# EAGLE design carSpd (EAGLE 8.0.1)

## Sheet 1 of 4
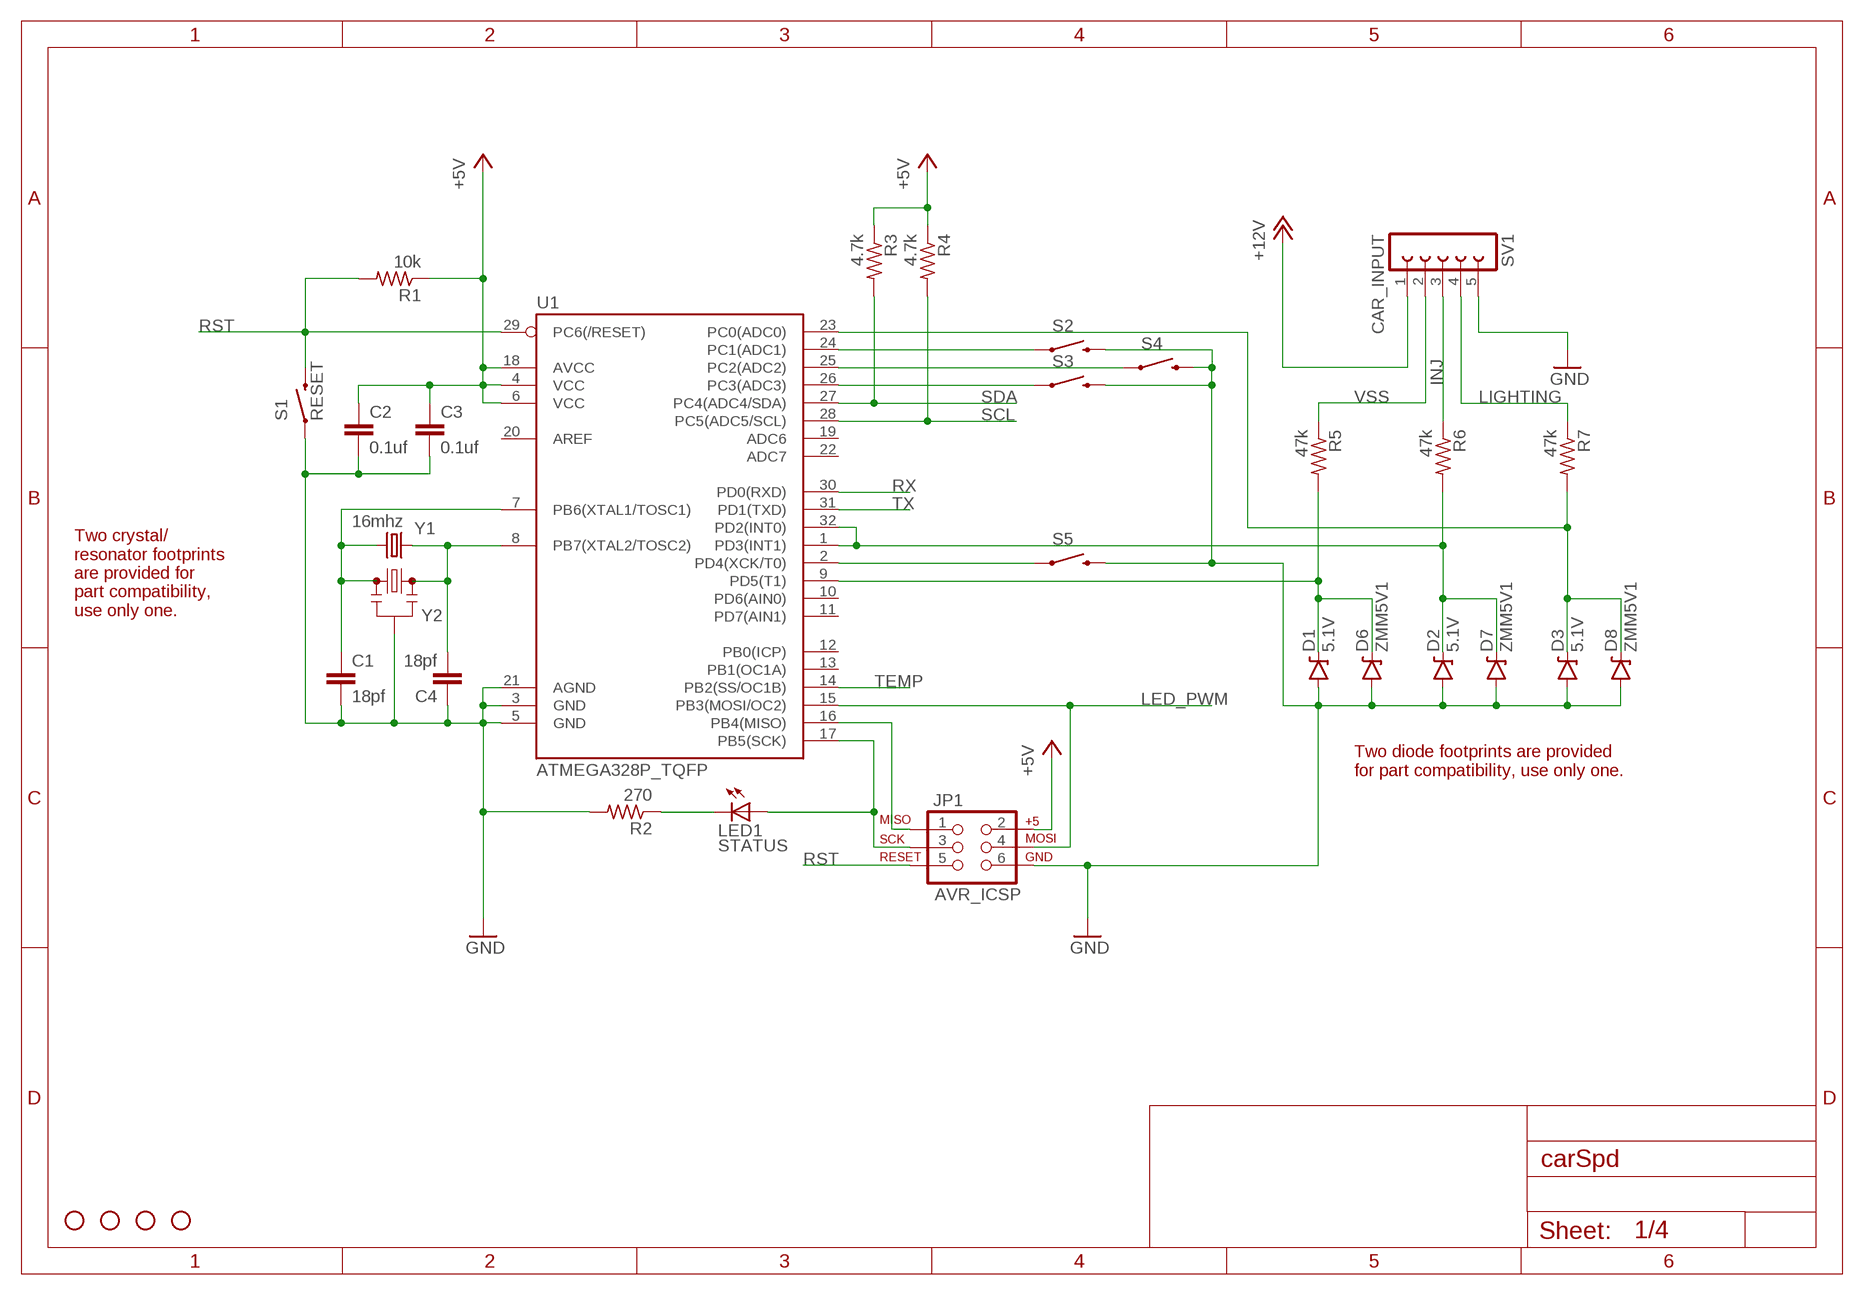
[diagram p0: schematic, sheet 1]

### Parts
C1  18pf  C-EUC0603K  [C0603K]
C2  0.1uf  C-EUC0603K  [C0603K]
C3  0.1uf  C-EUC0603K  [C0603K]
C4  18pf  C-EUC0603K  [C0603K]
D1  5.1V  DIODE-ZENER5.6V  [SOD-323]
D2  5.1V  DIODE-ZENER5.6V  [SOD-323]
D3  5.1V  DIODE-ZENER5.6V  [SOD-323]
D6  ZMM5V1  [SOD-80]
D7  ZMM5V1  [SOD-80]
D8  ZMM5V1  [SOD-80]
H1  STAND-OFF  [STAND-OFF]
H2  STAND-OFF  [STAND-OFF]
H3  STAND-OFF  [STAND-OFF]
H4  STAND-OFF  [STAND-OFF]
JP1  AVR_ICSP  AVR_SPI_PRG_6TESTPOINTS  [2X3_TEST_POINTS]
LED1  STATUS  LEDCHIPLED_0805  [CHIPLED_0805]
R1  10k  R-US_R0603  [R0603]
R2  270  R-US_R0603  [R0603]
R3  4.7k  R-US_R0805  [R0805]
R4  4.7k  R-US_R0805  [R0805]
R5  47k  R-US_R0805  [R0805]
R6  47k  R-US_R0805  [R0805]
R7  47k  R-US_R0805  [R0805]
S1  RESET  SWITCH-MOMENTARY-2SMD-1101NE  [TACTILE-SWITCH-1101NE]
S2  SWITCH-MOMENTARY-2SMD-1101NE  [TACTILE-SWITCH-1101NE]
S3  SWITCH-MOMENTARY-2SMD-1101NE  [TACTILE-SWITCH-1101NE]
S4  SWITCH-MOMENTARY-2SMD-1101NE  [TACTILE-SWITCH-1101NE]
S5  SWITCH-MOMENTARY-2SMD-1101NE  [TACTILE-SWITCH-1101NE]
SV1  CAR_INPUT  FE05W  [FE05W]
U1  ATMEGA328P_TQFP  [TQFP32-08]
Y1  16mhz  CRYSTAL5X3  [CRYSTAL-SMD-5X3]
Y2  16MHZ  RESONATOR16MHZ  [RESONATOR-SMD]

### Nets
+5V: C2.1 C3.1 JP1.2 R1.1 R3.1 R4.1 U1.4(VCC) U1.6(VCC) U1.18(AVCC) ; also sheet 2,3,4
+12V: SV1.1 ; also sheet 2
GND: C1.2 C2.2 C3.2 C4.1 D1.A D2.A D3.A D6.A D7.A D8.A JP1.6 R2.2 S1.1 S2.2 S3.2 S4.2 S5.2 SV1.5 U1.3(GND) U1.5(GND) U1.21(AGND) Y2.2 ; also sheet 2,3,4
INJ: R6.1 SV1.3
LED_PWM: JP1.4 U1.15(PB3(MOSI/OC2)) ; also sheet 4
LIGHTING: R7.1 SV1.4
N$5: S2.1 U1.24(PC1(ADC1))
N$6: S4.1 U1.25(PC2(ADC2))
N$7: S3.1 U1.26(PC3(ADC3))
N$13: S5.1 U1.2(PD4(XCK/T0))
N$22: JP1.1 U1.16(PB4(MISO))
N$24: C1.1 U1.7(PB6(XTAL1/TOSC1)) Y1.3 Y2.1
N$26: JP1.3 LED1.A U1.17(PB5(SCK))
N$30: D2.C D7.C R6.2 U1.1(PD3(INT1)) U1.32(PD2(INT0))
N$31: D3.C D8.C R7.2 U1.23(PC0(ADC0))
N$32: LED1.C R2.1
N$36: D1.C D6.C R5.2 U1.9(PD5(T1))
N$37: C4.2 U1.8(PB7(XTAL2/TOSC2)) Y1.1 Y2.3
RST: JP1.5 R1.2 S1.2 U1.29(PC6(/RESET)) ; also sheet 3
RX: U1.30(PD0(RXD)) ; also sheet 3
SCL: R4.2 U1.28(PC5(ADC5/SCL)) ; also sheet 4
SDA: R3.2 U1.27(PC4(ADC4/SDA)) ; also sheet 4
TEMP: U1.14(PB2(SS/OC1B)) ; also sheet 4
TX: U1.31(PD1(TXD)) ; also sheet 3
VSS: R5.1 SV1.2
Unconnected: U1.10(PD6(AIN0)) U1.11(PD7(AIN1)) U1.12(PB0(ICP)) U1.13(PB1(OC1A)) U1.19(ADC6) U1.20(AREF) U1.22(ADC7)

### Notes on the sheet
- Two crystal/
  resonator footprints
  are provided for 
  part compatibility,
  use only one.
- Two diode footprints are provided
  for part compatibility, use only one.

## Sheet 2 of 4: Power Regulation
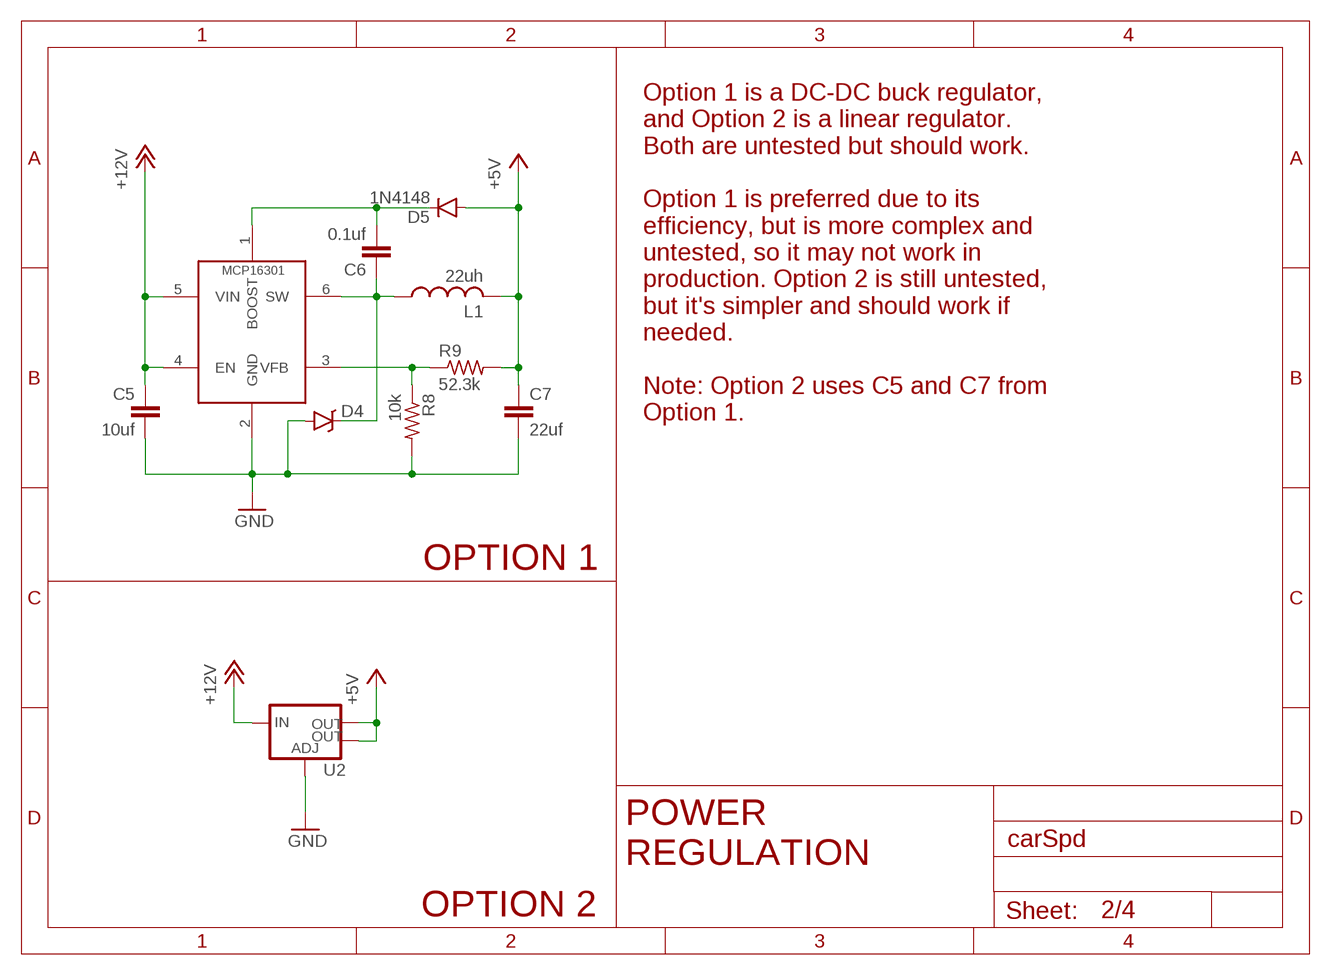
[diagram p1: schematic, sheet 2]

### Parts
C5  10uf  C-EUC0603K  [C0603K]
C6  0.1uf  C-EUC0603K  [C0603K]
C7  22uf  C-EUC0603K  [C0603K]
D4  DIODE-SCHOTTKY-BAT20J  [SOD-323]
D5  1N4148  DIODEBAS16  [SOD-323]
IC1  MCP16301/H  [SOT23-6]
L1  22uh  CBC2518T220M  [IND-1007/2518]
R8  10k  R-US_R0603  [R0603]
R9  52.3k  R-US_R0603  [R0603]
U2  V_REG_LM1117SOT223  [SOT223]

### Nets
+5V: C7.1 D5.A L1.P$2 R9.2 U2.2(OUT) U2.4(OUT) ; also sheet 1,3,4
+12V: C5.1 IC1.4(EN) IC1.5(VIN) U2.3(IN) ; also sheet 1
GND: C5.2 C7.2 D4.A IC1.2(GND) R8.2 U2.1(ADJ) ; also sheet 1,3,4
N$1: IC1.3(VFB) R8.1 R9.1
N$18: C6.1 D4.C IC1.6(SW) L1.P$1
N$19: C6.2 D5.C IC1.1(BOOST)

### Notes on the sheet
- MCP16301
- Option 1 is a DC-DC buck regulator,
  and Option 2 is a linear regulator.
  Both are untested but should work.
  
  Option 1 is preferred due to its
  efficiency, but is more complex and
  untested, so it may not work in 
  production. Option 2 is still untested,
  but it's simpler and should work if
  needed.
  
  Note: Option 2 uses C5 and C7 from
  Option 1.
- OPTION 1
- POWER
  REGULATION
- OPTION 2

## Sheet 3 of 4: USB to Serial
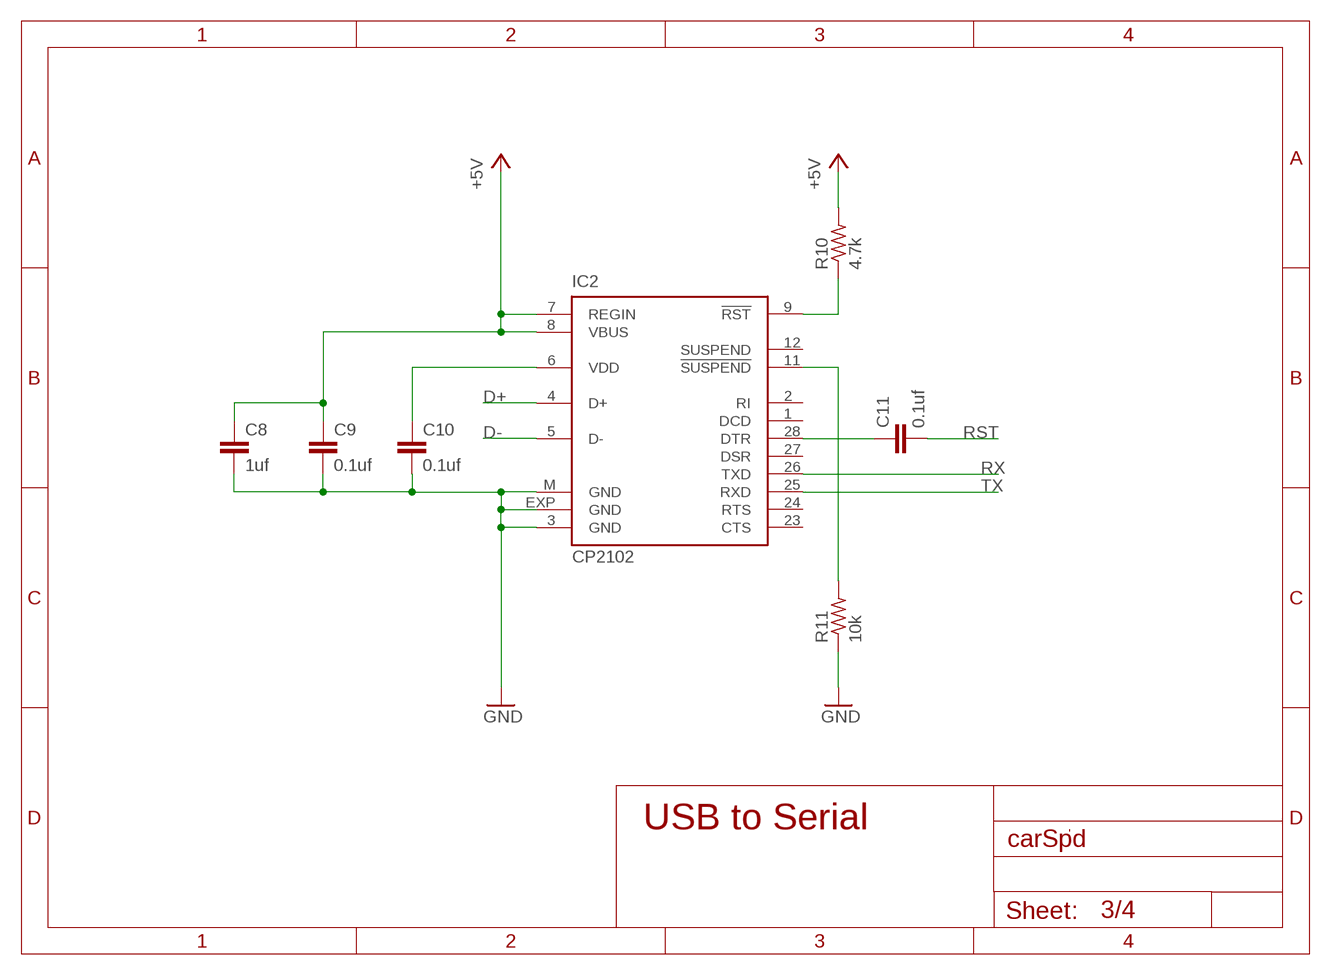
[diagram p2: schematic, sheet 3]

### Parts
C8  1uf  C-EUC0805K  [C0805K]
C9  0.1uf  C-EUC0603K  [C0603K]
C10  0.1uf  C-EUC0603K  [C0603K]
C11  0.1uf  C-EUC0603K  [C0603K]
IC2  CP2102  [MLP28]
R10  4.7k  R-US_R0805  [R0805]
R11  10k  R-US_R0603  [R0603]

### Nets
+5V: C8.1 C9.1 IC2.7(REGIN) IC2.8(VBUS) R10.2 ; also sheet 1,2,4
D+: IC2.4(D+) ; also sheet 4
D-: IC2.5(D-) ; also sheet 4
GND: C8.2 C9.2 C10.2 IC2.3(GND) IC2.EXP(GND) IC2.M(GND) R11.1 ; also sheet 1,2,4
N$4: IC2.9(!RST) R10.1
N$8: IC2.11(!SUSPEND) R11.2
N$10: C11.1 IC2.28(DTR)
N$12: C10.1 IC2.6(VDD)
RST: C11.2 ; also sheet 1
RX: IC2.26(TXD) ; also sheet 1
TX: IC2.25(RXD) ; also sheet 1
Unconnected: IC2.1(DCD) IC2.2(RI) IC2.12(SUSPEND) IC2.23(CTS) IC2.24(RTS) IC2.27(DSR)

### Notes on the sheet
- USB to Serial

## Sheet 4 of 4: Peripherals
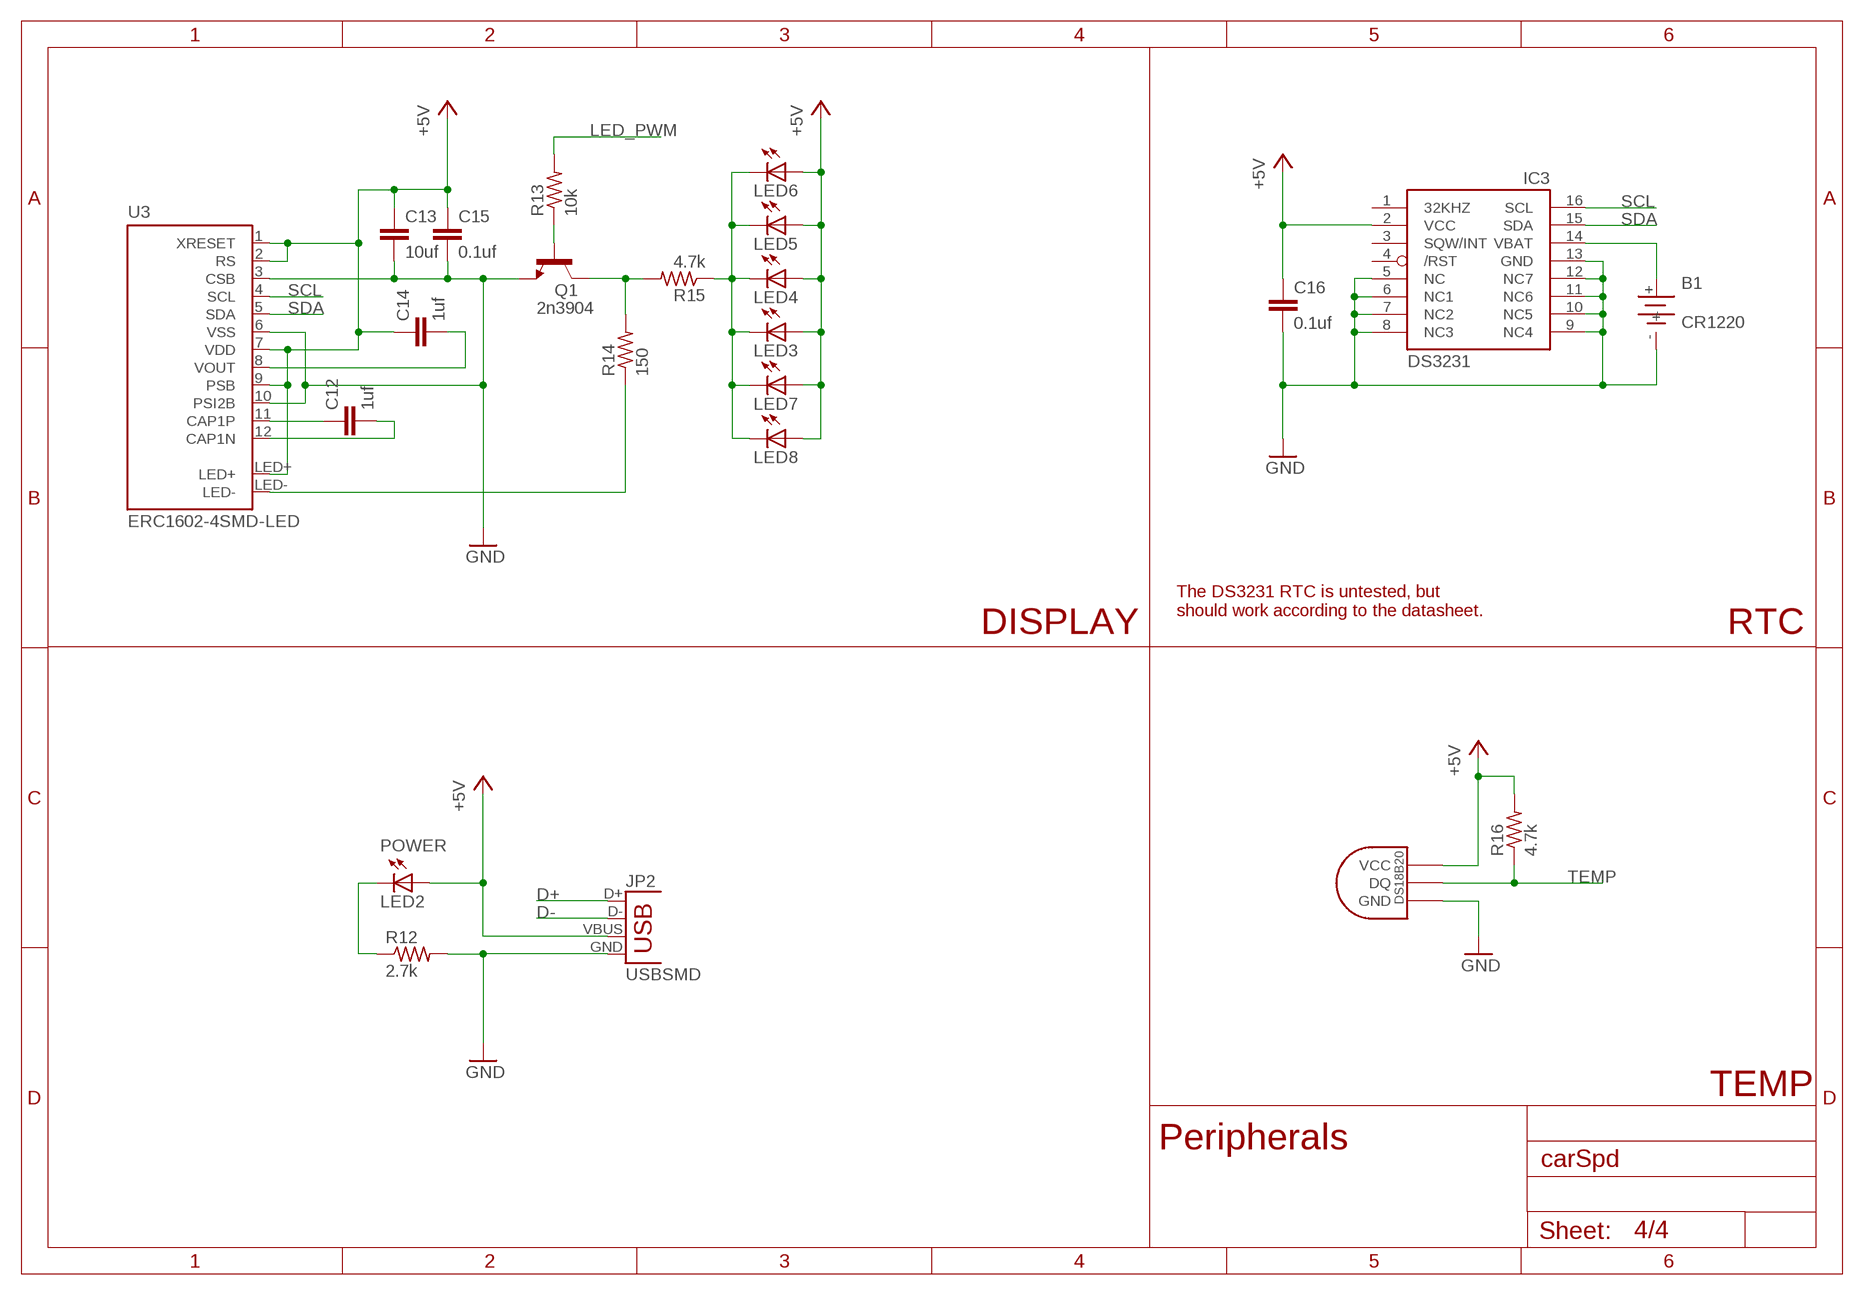
[diagram p3: schematic, sheet 4]

### Parts
B1  CR1220  BATTERY1220  [1220-SMD]
C12  1uf  C-EUC0805K  [C0805K]
C13  10uf  C-EUC0603K  [C0603K]
C14  1uf  C-EUC0805K  [C0805K]
C15  0.1uf  C-EUC0603K  [C0603K]
C16  0.1uf  C-EUC0603K  [C0603K]
IC3  DS3231/SO  [SO16W]
JP2  USBSMD  [USB-MINIB]
LED2  POWER  LEDCHIPLED_0805  [CHIPLED_0805]
LED3  LEDCHIPLED_0805  [CHIPLED_0805]
LED4  LEDCHIPLED_0805  [CHIPLED_0805]
LED5  LEDCHIPLED_0805  [CHIPLED_0805]
LED6  LEDCHIPLED_0805  [CHIPLED_0805]
LED7  LEDCHIPLED_0805  [CHIPLED_0805]
LED8  LEDCHIPLED_0805  [CHIPLED_0805]
Q1  2n3904  TRANSISTOR_NPNSOT23-3  [SOT23-3]
R12  2.7k  R-US_R0603  [R0603]
R13  10k  R-US_R0603  [R0603]
R14  150  R-US_R0603  [R0603]
R15  4.7k  R-US_R0805  [R0805]
R16  4.7k  R-US_R0805  [R0805]
U3  ERC1602-4SMD-LED  [ERC1602-4_SMDLED]
U4  DS1820  [µSOP8]

### Nets
+5V: C13.1 C14.1 C15.1 C16.1 IC3.2(VCC) JP2.VBUS LED2.A LED3.A LED4.A LED5.A LED6.A LED7.A LED8.A R16.2 U3.1(XRESET) U3.2(RS) U3.7(VDD) U3.9(PSB) U3.LED+ U4.8(VCC) ; also sheet 1,2,3
D+: JP2.D+ ; also sheet 3
D-: JP2.D- ; also sheet 3
GND: B1.- C13.2 C15.2 C16.2 IC3.5(NC) IC3.6(NC1) IC3.7(NC2) IC3.8(NC3) IC3.9(NC4) IC3.10(NC5) IC3.11(NC6) IC3.12(NC7) IC3.13(GND) JP2.GND Q1.2(E) R12.2 U3.3(CSB) U3.6(VSS) U3.10(PSI2B) U4.4(GND) ; also sheet 1,2,3
LED_PWM: R13.2 ; also sheet 1
N$2: LED3.C LED4.C LED5.C LED6.C LED7.C LED8.C R15.1
N$3: LED2.C R12.1
N$11: Q1.1(B) R13.1
N$14: C14.2 U3.8(VOUT)
N$15: Q1.3(C) R14.2 R15.2
N$16: R14.1 U3.LED-
N$20: C12.1 U3.11(CAP1P)
N$21: C12.2 U3.12(CAP1N)
N$27: B1.+ IC3.14(VBAT)
SCL: IC3.16(SCL) U3.4(SCL) ; also sheet 1
SDA: IC3.15(SDA) U3.5(SDA) ; also sheet 1
TEMP: R16.1 U4.1(DQ) ; also sheet 1
Unconnected: IC3.1(32KHZ) IC3.3(SQW/INT) IC3.4(/RST)

### Notes on the sheet
- The DS3231 RTC is untested, but 
  should work according to the datasheet.
- DISPLAY | RTC
- TEMP
- Peripherals

## Library data of the parts
B1 = Battery&Holder:BATTERY
C1-C16 = rcl:C-EU: CAPACITOR, European symbol
D1-D3 = SparkFun-DiscreteSemi:DIODE-ZENER: Zener Diode Production Part - 8199 3.4V Zener Voltage; PROD_ID: DIO-12442; VALUE: 5.6V
D4 = SparkFun-DiscreteSemi:DIODE-SCHOTTKY: Schottky diodes in SFE's production catalog BAT20J 1A 23V 0.62Vf RB751 120mA 40V 0.37Vf PMEG4005EJ 0.5A 40V 0.42Vf MBRA140 1A 40V 0.5Vf B340A 3A 40V SMA; PROD_ID: DIO-11623; VALUE: BAT20J
D5 = SparkFun-DiscreteSemi:DIODE: Diode These are standard reverse protection diodes and small signal diodes. SMA package can handle up to about 1A. SOD-323 can handle about 200mA. What the SOD-323 package when ordering, there are some mfgs out there that are 5-pin packages.; PROD_ID: DIO-09646; VALUE: 250mA/100V
D6-D8 = hybridair:ZMM5V1
H1-H4 = SparkFun-Hardware:STAND-OFF: Stand Off Drill holes for mechanically mounting via screws, standoffs, etc. Note: Use the keepout ring to avoid running the screw head into surrounding components. Variant Overviews STAND-OFF - Mechanical footprint for a #4 phillips button head screw. STAND-OFF-TIGHT - Mechanical footprint for a #4 phillips button head screw, Example SparkFun Products Screw - Phillips Head (1/4", 4-40, 10 pack) <https://www.sparkfun.com/products/10453> (PRT-10453) Screw - Phillips Head (1/2", 4-40, 10 pack) <https://www.sparkfun.com/products/10452> (PRT-10452) Screw - Phillips Head (3/4", 4-40, 10 pack) <https://www.sparkfun.com/products/10451> (PRT-10451) Screw - Phillips Head (1", 4-40, 10 pack) <https://www.sparkfun.com/products/10450> (PRT-10450)
IC1 = MCP16301:MCP16301/H: High-Voltage Input Integrated Switch Step-Down Regulator
IC2 = silabs:CP210*: Single-Chip USB to UART Bridge Source: www.silabs.com .. CP2101.pdf / cp2102.pdf; MF: FARNELL; MPN: CP2102-GM; OC_FARNELL: 9282130; OC_NEWARK: 30K5635
IC3 = adafruit:DS3231
JP1 = SparkFun-Connectors:AVR_SPI_PRG_6: AVR ISP 6 Pin This is the reduced ISP connector for AVR programming. Common on Arduino. This footprint will take up less PCB space and can be used with a 10-pin to 6-pin adapter such as SKU: BOB-08508 **Special note about "TEST_POINT" package. The stop mask is on the top side, so if you want your programming test points to be on the bottom of your board, make sure to place this package on the bottom side of the board. This also ensure that the orientation to program from the bottom side will be correct.
JP2 = SparkFun-Connectors:USB: USB Connectors USB-B-PTH is fully proven SKU : PRT-00139/CONN-08278 USB-miniB is fully proven SKU : PRT-00587 USB-A-PCB is untested. USB-A-H is throughly reviewed, but untested. Spark Fun Electronics SKU : PRT-00437 USB-B-SMT is throughly reviewed, but untested. Needs silkscreen touching up. USB-A-S has not been used/tested USB-MB-H has not been used/tested USB-MICROB has been used. CONN-09505; PROD_ID: CONN-08193
L1 = hybridair:CBC2518T220M: https://www.digikey.ca/product-detail/en/taiyo-yuden/CBC2518T220M/587-1616-1-ND/1008231
LED1-LED8 = led:LED: LED OSRAM: - CHIPLED LG R971, LG N971, LY N971, LG Q971, LY Q971, LO R971, LY R971 LH N974, LH R974 LS Q976, LO Q976, LY Q976 LO Q996 - Hyper CHIPLED LW Q18S LB Q993, LB Q99A, LB R99A - SideLED LS A670, LO A670, LY A670, LG A670, LP A670 LB A673, LV A673, LT A673, LW A673 LH A674 LY A675 LS A676, LA A676, LO A676, LY A676, LW A676 LS A679, LY A679, LG A679 - Hyper Micro SIDELED® LS Y876, LA Y876, LO Y876, LY Y876 LT Y87S - SmartLED LW L88C, LW L88S LB L89C, LB L89S, LG L890 LS L89K, LO L89K, LY L89K LS L896, LA L896, LO L896, LY L896 - TOPLED LS T670, LO T670, LY T670, LG T670, LP T670 LSG T670, LSP T670, LSY T670, LOP T670, LYG T670 LG T671, LOG T671, LSG T671 LB T673, LV T673, LT T673, LW T673 LH T674 LS T676, LA T676, LO T676, LY T676, LB T676, LH T676, LSB T676, LW T676 LB T67C, LV T67C, LT T67C, LS T67K, LO T67K, LY T67K, LW E67C LS E67B, LA E67B, LO E67B, LY E67B, LB E67C, LV E67C, LT E67C LW T67C LS T679, LY T679, LG T679 LS T770, LO T770, LY T770, LG T770, LP T770 LB T773, LV T773, LT T773, LW T773 LH T774 LS E675, LA E675, LY E675, LS T675 LS T776, LA T776, LO T776, LY T776, LB T776 LHGB T686 LT T68C, LB T68C - Hyper Mini TOPLED® LB M676 - Mini TOPLED Santana® LG M470 LS M47K, LO M47K, LY M47K Source: http://www.osram.convergy.de LUXEON: - LUMILED® LXK2-PW12-R00, LXK2-PW12-S00, LXK2-PW14-U00, LXK2-PW14-V00 LXK2-PM12-R00, LXK2-PM12-S00, LXK2-PM14-U00 LXK2-PE12-Q00, LXK2-PE12-R00, LXK2-PE12-S00, LXK2-PE14-T00, LXK2-PE14-U00 LXK2-PB12-K00, LXK2-PB12-L00, LXK2-PB12-M00, LXK2-PB14-N00, LXK2-PB14-P00, LXK2-PB14-Q00 LXK2-PR12-L00, LXK2-PR12-M00, LXK2-PR14-Q00, LXK2-PR14-R00 LXK2-PD12-Q00, LXK2-PD12-R00, LXK2-PD12-S00 LXK2-PH12-R00, LXK2-PH12-S00 LXK2-PL12-P00, LXK2-PL12-Q00, LXK2-PL12-R00 Source: www.luxeon.com KINGBRIGHT: KA-3528ASYC Source: www.kingbright.com
Q1 = SparkFun-DiscreteSemi:TRANSISTOR_NPN: Generic NPN BJT MMBT2222A - TRANS-08049 (SOT-23, 1A 40V) MPSA42 - TRANS-09116 (SOT-23, 500mA 300V) MMBT5088LT1G - TRANS-11160 (SOT-23, 50 mA 30V) BC547 - COM-08928 <http://www.sparkfun.com/products/8928> (TO-92 45V 100mA) (1.Collector 2.Base 3.Emitter) 2N3904 - COM-00521 <http://www.sparkfun.com/products/521> (TO-92 40V 200mA) (1.Emitter 2.Base 3.Collector) P2N2222A - COM-12852 <http://www.sparkfun.com/products/12852> (TO-92 40V 600mA) (1.Collector 2.Base 3.Emitter); PROD_ID: TRANS-08049
R1-R16 = rcl:R-US_: RESISTOR, American symbol
S1-S5 = SparkFun-Electromechanical:SWITCH-MOMENTARY-2: Various NO switches- pushbuttons, reed, etc; PROD_ID: SWCH-00815
SV1 = con-lsta:FE05W: FEMALE HEADER; OC_FARNELL: unknown; OC_NEWARK: unknown
U1 = SparkFun-DigitalIC:ATMEGA328P_TQFP; PROD_ID: IC-09069
U2 = SparkFun-IC-Power:V_REG_LM1117: Voltage Regulator LM1117 Standard adjustable voltage regulator but in SMD form. Spark Fun Electronics SKU : COM-00595; PROD_ID: VREG-08170
U3 = hybridair:ERC1602-4: ERC1602-4 LCD from buydisplay
U4 = Ava:DS1820: DS18B20 Programmable Resolution 1-Wire Digital Thermometer Description The DS18B20 digital thermometer provides 9-bit to 12-bit Celsius temperature measurements and has an alarm function with nonvolatile user-programmable upper and lower trigger points. The DS18B20 communicates over a 1-Wire® bus that by definition requires only one data line (and ground) for communication with a central microprocessor. It has an operating temperature range of -55°C to +125°C and is accurate to ±0.5°C over the range of -10°C to +85°C. In addition, the DS18B20 can derive power directly from the data line ("parasite power"), eliminating the need for an external power supply. Each DS18B20 has a unique 64-bit serial code, which allows multiple DS18B20s to function on the same 1-Wire bus. Thus, it is simple to use one microprocessor to control many DS18B20s distributed over a large area. Applications that can benefit from this feature include HVAC environmental controls, temperature monitoring systems inside buildings, equipment, or machinery, and process monitoring and control systems.
Y1 = SparkFun-FreqCtrl:CRYSTAL: Various standard crystals. Proven footprints.; PROD_ID: XTAL-08218
Y2 = SparkFun-FreqCtrl:RESONATOR: Resonator Small SMD resonator. Used, eg, on the Arduino Pro/ Pro Mini boards. 8MHz- XTAL-08895 16MHz- XTAL-08900; PROD_ID: XTAL-08900

## Board
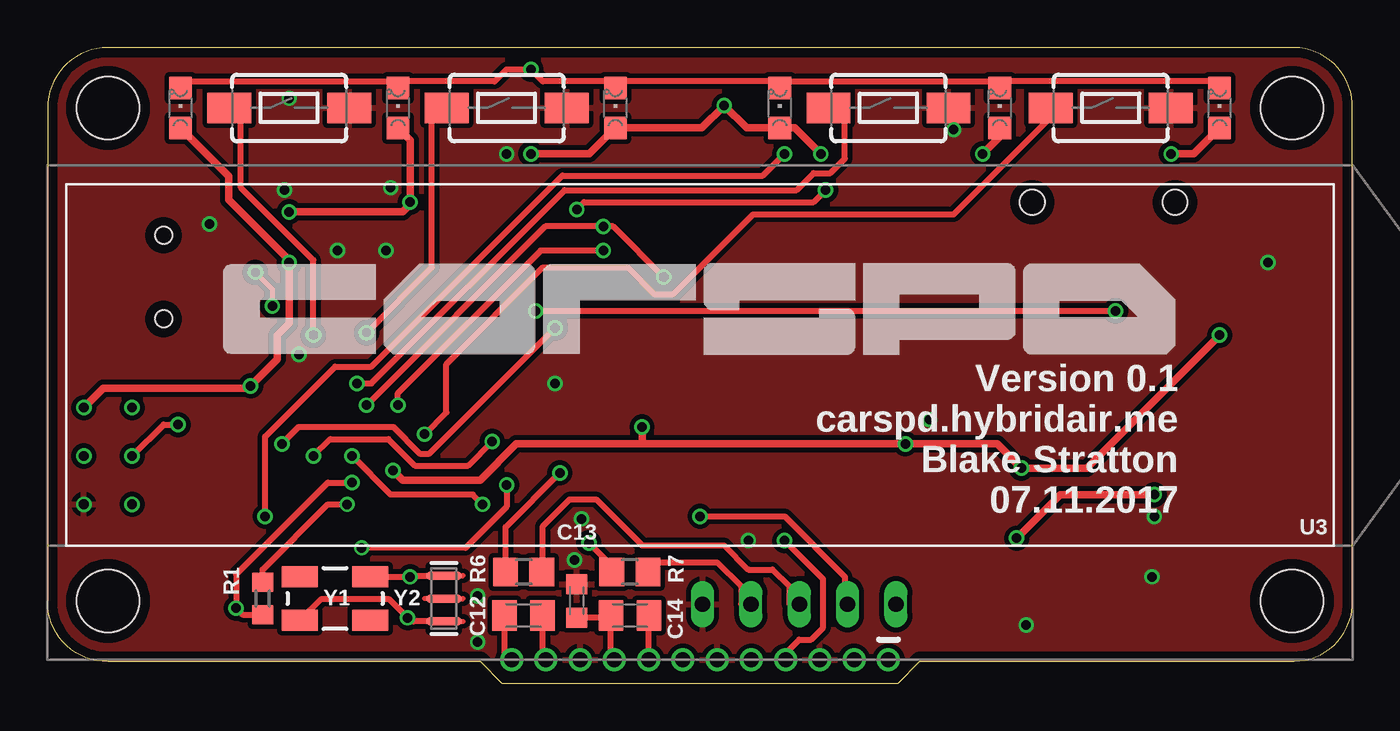
[diagram p4: board, top side]
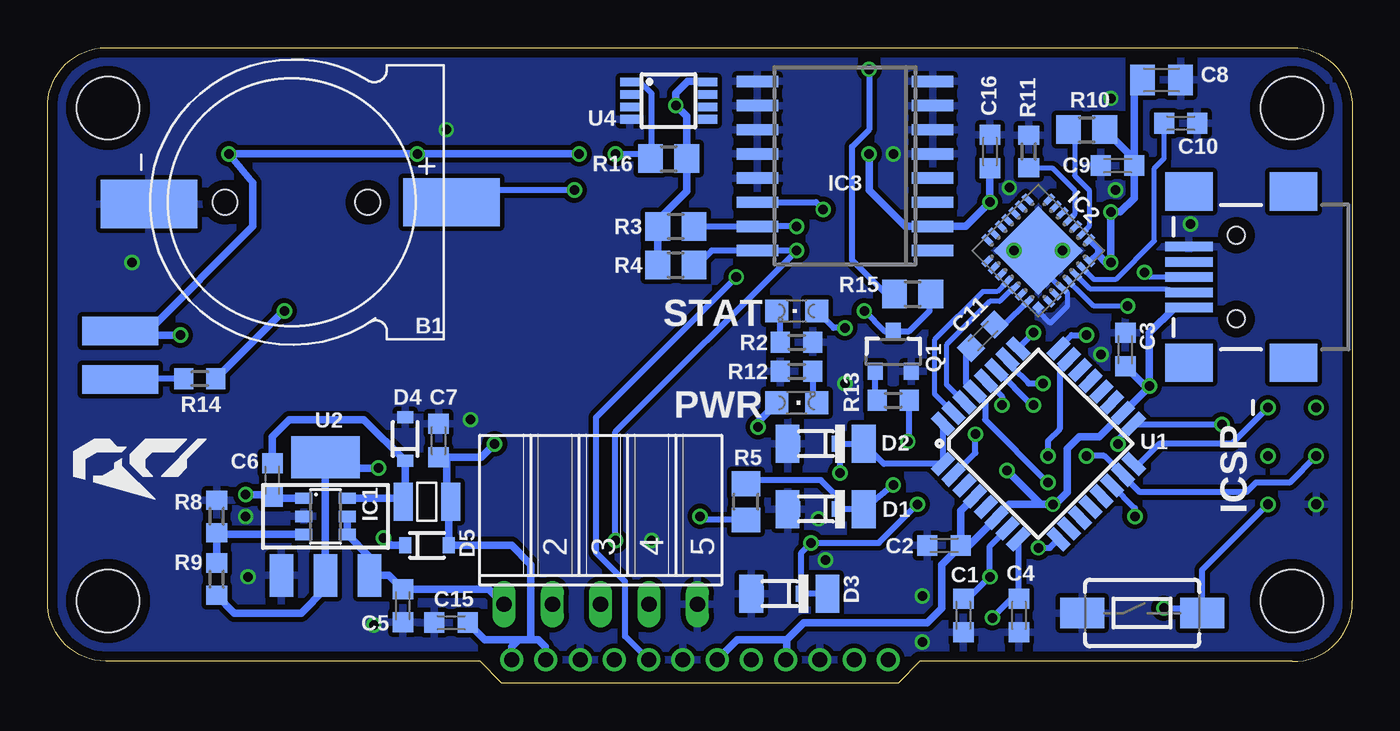
[diagram p5: board, bottom side, seen from below]

Size 68.58 x 33.4 mm. Coordinates in mm from the lower left corner, seen from the top.
Outline: 3.17,1.14 22.73,1.14 23.88,0 44.7,0 45.85,1.14 65.53,1.14 arc90 68.58,4.32 68.58,30.23 arc90 65.53,33.4 3.17,33.4 arc90 0,30.23 0,4.32 arc92 3.17,1.14
Copper layers (1*16): Top 0.035mm / dielectric 1.6mm / Bottom 0.035mm
Design rules "Elecrow_2-layer_PCB_eagle_rule": minimum track width 6mil, minimum drill 12mil, track to track 6mil, track to pad 6mil, pad to pad 6mil, via to via 8mil, smd to smd 0mil, copper to edge 20mil, drill to drill 10mil, minimum pad ring 6mil, minimum via ring 6mil, stop-mask expansion 0mil, vias tented up to drill 100mil, thermal gap 10mil

### Footprints (pad centres in the part's own frame; a part is rotated, then mirrored left to right if it is on the bottom)
1220-SMD = smd 5.08 x 2.54: + 8.4,0; - -7.5,-0.1 | hole 1.3: 4,0; -3.5,0
C0603K = smd 1.05 x 1.08: 1 -0.875,0; 2 0.875,0
C0805K = smd 1.3 x 1.6: 1 -1,0; 2 1,0
SOD-323 = smd 0.63 x 0.83: A 1.15,0; C -1.15,0
SOD-80 = smd 1.25 x 2: A 2,0; C -2,0
STAND-OFF = hole 3.302: 0,0
SOT23-6 = smd 0.6 x 0.9: 1 -0.95,-1.15; 2 0,-1.15; 3 0.95,-1.15; 4 0.95,1.15; 5 0,1.15; 6 -0.95,1.15
MLP28 = smd 0.6 x 0.3: 1 -2.3,1.5; 2 -2.3,1; 3 -2.3,0.5; 4 -2.3,0; 5 -2.3,-0.5; 6 -2.3,-1; 7 -2.3,-1.5; 15 2.3,-1.5; 16 2.3,-1; 17 2.3,-0.5; 18 2.3,0; 19 2.3,0.5; 20 2.3,1; 21 2.3,1.5 | smd 0.3 x 0.6: 8 -1.5,-2.3; 9 -1,-2.3; 10 -0.5,-2.3; 11 0,-2.3; 12 0.5,-2.3; 13 1,-2.3; 14 1.5,-2.3; 22 1.5,2.3; 23 1,2.3; 24 0.5,2.3; 25 0,2.3; 26 -0.5,2.3; 27 -1,2.3; 28 -1.5,2.3 | smd 3.3 x 3.3: EXP 0,0 | smd 0.435 x 0.435: M -2.103,2.103
SO16W = smd 0.6 x 2.2: 1 -4.445,-4.6; 2 -3.175,-4.6; 3 -1.905,-4.6; 4 -0.635,-4.6; 5 0.635,-4.6; 6 1.905,-4.6; 7 3.175,-4.6; 8 4.445,-4.6; 9 4.445,4.6; 10 3.175,4.6; 11 1.905,4.6; 12 0.635,4.6; 13 -0.635,4.6; 14 -1.905,4.6; 15 -3.175,4.6; 16 -4.445,4.6
2X3_TEST_POINTS = drill 0.508: 1 -2.54,-1.27; 2 -2.54,1.27; 3 0,-1.27; 4 0,1.27; 5 2.54,-1.27; 6 2.54,1.27
USB-MINIB = smd 2.5 x 0.5: D+ 2.5,0; D- 2.5,0.8; GND 2.5,-1.6; ID 2.5,-0.8; VBUS 2.5,1.6 | smd 2.5 x 2: MTN1 -3,4.5; MTN2 2.5,4.5; MTN3 -3,-4.5; MTN4 2.5,-4.5 | hole 0.9: 0,2.2; 0,-2.2
IND-1007/2518 = smd 1 x 2: P$1 -1.25,0; P$2 1.25,0
CHIPLED_0805 = smd 1.2 x 1.2: A 0,-1.05; C 0,1.05
SOT23-3 = smd 0.8 x 0.9: 1 -0.95,-1; 2 0.95,-1; 3 0,1.1
R0603 = smd 1 x 1.1: 1 -0.85,0; 2 0.85,0
R0805 = smd 1.3 x 1.5: 1 -0.95,0; 2 0.95,0
TACTILE-SWITCH-1101NE = smd 2.3 x 1.6: 1 -3.15,0; 2 3.15,0
FE05W = drill 0.813 long: 1 -5.08,0; 2 -2.54,0; 3 0,0; 4 2.54,0; 5 5.08,0
TQFP32-08 = smd 1.27 x 0.559: 1 -4.293,2.8; 2 -4.293,2; 3 -4.293,1.2; 4 -4.293,0.4; 5 -4.293,-0.4; 6 -4.293,-1.2; 7 -4.293,-2; 8 -4.293,-2.8; 17 4.293,-2.8; 18 4.293,-2; 19 4.293,-1.2; 20 4.293,-0.4; 21 4.293,0.4; 22 4.293,1.2; 23 4.293,2; 24 4.293,2.8 | smd 0.559 x 1.27: 9 -2.8,-4.293; 10 -2,-4.293; 11 -1.2,-4.293; 12 -0.4,-4.293; 13 0.4,-4.293; 14 1.2,-4.293; 15 2,-4.293; 16 2.8,-4.293; 25 2.8,4.293; 26 2,4.293; 27 1.2,4.293; 28 0.4,4.293; 29 -0.4,4.293; 30 -1.2,4.293; 31 -2,4.293; 32 -2.8,4.293
SOT223 = smd 1.219 x 2.235: 1 -2.311,-3.099; 2 0,-3.099; 3 2.311,-3.099 | smd 3.6 x 2.2: 4 0,3.099
ERC1602-4_SMDLED = drill 0.8: 1 9.9,-14.27; 2 8.1,-14.27; 3 6.3,-14.27; 4 4.5,-14.27; 5 2.7,-14.27; 6 0.9,-14.27; 7 -0.9,-14.27; 8 -2.7,-14.27; 9 -4.5,-14.27; 10 -6.3,-14.27; 11 -8.1,-14.27; 12 -9.9,-14.27 | smd 4 x 1.5 bottom: LED+ 30.48,3; LED- 30.48,0.46
µSOP8 = smd 0.45 x 1: 1 -0.975,-2.05; 2 -0.325,-2.05; 3 0.325,-2.05; 4 0.975,-2.05; 5 0.975,2.05; 6 0.325,2.05; 7 -0.325,2.05; 8 -0.975,2.05
CRYSTAL-SMD-5X3 = smd 1.9 x 1.1: 1 -1.85,-1.15; 2 1.85,-1.15; 3 1.85,1.15; 4 -1.85,1.15
RESONATOR-SMD = smd 0.45 x 1.905: 1 -1.2,0; 2 0,0; 3 1.2,0

### Placement (x,y rotation side)
B1  55.75,25.27 0 bottom
C1  20.45,3.56 270 bottom
C2  21.46,7.24 180 bottom
C3  11.94,17.53 90 bottom
C4  17.53,3.56 90 bottom
C5  49.91,4.06 270 bottom
C6  56.77,10.67 270 bottom
C7  48.03,12.75 90 bottom
C8  10.03,31.7 0 bottom
C9  12.34,27.2 180 bottom
C10  9.02,29.42 0 bottom
C11  19.42,18.23 225 bottom
C12  25.02,3.56 180 top
C13  27.81,4.32 90 top
C14  30.61,3.56 0 top
C15  47.37,3.17 180 bottom
C16  19.05,27.94 90 bottom
D1  28.19,9.14 180 bottom
D2  28.19,12.57 180 bottom
D3  30.1,4.7 180 bottom
D4  49.78,12.83 90 bottom
D5  48.64,7.24 0 bottom
D6  27.69,9.14 180 bottom
D7  27.69,12.57 180 bottom
D8  29.59,4.7 180 bottom
H1  3.17,4.32 0 top
H2  65.41,30.23 0 top
H3  3.17,30.23 0 top
H4  65.41,4.32 0 top
IC1  53.98,8.76 270 bottom
IC2  16.51,22.73 135 bottom
IC3  26.67,27.18 90 bottom
JP1  3.17,11.94 270 bottom
JP2  6.1,21.34 180 bottom
L1  48.64,9.53 0 bottom
LED1  29.21,19.56 90 bottom
LED2  29.21,14.73 270 bottom
LED3  6.99,30.23 0 top
LED4  29.84,30.23 0 top
LED5  38.48,30.23 0 top
LED6  61.59,30.23 0 top
LED7  18.41,30.23 0 top
LED8  50.04,30.23 0 top
Q1  24.13,17.4 0 bottom
R1  11.3,4.44 270 top
R2  29.21,17.91 0 bottom
R3  35.56,24 0 bottom
R4  35.56,21.97 0 bottom
R5  31.88,9.53 90 bottom
R6  25.02,5.84 180 top
R7  30.61,5.84 180 top
R8  59.69,8.76 90 bottom
R9  59.69,5.46 270 bottom
R10  13.97,29.08 0 bottom
R11  17.02,27.94 270 bottom
R12  29.21,16.38 180 bottom
R13  24.13,14.86 0 bottom
R14  60.58,16 0 bottom
R15  23.11,20.45 0 bottom
R16  35.94,27.56 0 bottom
S1  11.05,3.68 0 bottom
S2  12.7,30.23 0 top
S3  44.2,30.23 0 top
S4  24.13,30.23 0 top
S5  55.88,30.23 0 top
SV1  39.51,4.14 0 bottom
U1  16.51,12.57 45 bottom
U2  53.98,8.76 0 bottom
U3  34.29,15.49 0 top
U4  35.94,30.61 270 bottom
U$1  [AR1]  67.31,9.65 0 bottom
U$2  [CARSPD]  34.29,17.27 0 top
Y1  15.11,4.44 0 top
Y2  20.83,4.44 270 top

### Tracks (layer width: path | path; a pad name or v marks a point on that pad's centre or on a via)
+5V  (via drill 0.5)
  Top 0.305: U3.9 29.61,1.41 C14.1 29.49,3.44 C13.1 | R1.1 11.3,5.97 14.73,9.4 v15.75,9.4
  Top 0.406: JP1.2 2.92,15.49 10.54,15.49 v10.67,15.62 12.06,17.02 12.06,18.29 12.7,18.92 v12.7,22.1 12.7,22.22 9.53,25.4 9.53,26.64 LED3.A | v12.7,24.77 18.67,24.77 19.05,25.15 v19.05,25.27 19.05,28.54 LED7.A | 25.4,28.03 v25.4,27.81 28.48,27.81 LED4.A 34.38,29.18 v35.56,30.35 36.74,29.18 LED5.A 39.28,29.18 v40.64,27.81 | v18.16,11.18 18.67,10.67 22.73,10.67 24.64,12.57 31.24,12.57 | LED6.A 60.23,27.81 v59.05,27.81 | 31.24,12.57 v45.09,12.57 49.91,12.57 v51.18,11.3 54.61,11.3 v61.59,18.29 | 31.24,12.57 v31.24,13.46 | v49.15,27.81 50.04,28.7 LED8.A
  Bottom 0.305: 18.62,8.69 U1.6 18.74,8.69 | U3.9 29.84,1.27 | 20.59,7.22 C2.1 20.15,7.24 | v10.67,15.62 10.92,15.63 | IC2.8 13.34,22.81 13.34,22.73 13.34,22.65 IC2.7 | R10.2 12.98,29.16 | 33.93,31.62 U4.8 | 36.2,24.64 36.2,24.32 R3.1 | 63.29,18.49 63.5,18.49 U3.LED+
  Bottom 0.406: v15.75,9.4 18.03,9.4 18.54,8.89 18.62,8.69 | 29.84,1.27 29.72,1.4 29.72,2.29 | 29.72,2.29 28.83,3.17 22.35,3.17 21.59,3.94 21.59,6.22 20.59,7.22 | 20.15,7.24 U1.6 | U1.4 20.59,9.06 C2.1 | 10.92,15.63 C3.1 | JP2.VBUS 9.35,19.74 10.67,18.41 v10.67,15.62 10.79,15.46 U1.18 13.3,12.95 14.35,12.95 14.99,12.32 14.99,10.03 15.62,9.4 v15.75,9.4 | 13.34,22.73 13.34,22.48 12.95,22.1 v12.7,22.1 v12.7,24.77 12.19,24.77 11.47,25.49 C9.1 | 11.34,27.07 C9.1 | C8.1 11.47,31.26 C9.1 | C16.1 v19.05,25.27 20.32,24 IC3.2 23.5,24 25.4,25.91 v25.4,27.81 | 33.93,31.62 34.92,31.62 35.56,30.99 v35.56,30.35 34.99,29.78 R16.2 34.99,25.84 36.2,24.64 | R3.1 R4.1 | 29.72,2.29 32.33,2.29 U3.7 | U3.1 44.19,1.91 43.81,2.29 | 43.18,2.29 43.81,2.29 | 43.18,2.29 42.8,2.29 42.42,1.91 42.42,1.25 U3.2 | 63.29,18.49 57.78,24 57.78,26.29 v59.05,27.81 v49.15,27.81 v40.64,27.81 | v51.18,11.3 53.42,11.3 U2.4 U2.2 53.98,4.95 55.24,3.68 58.76,3.68 R9.2 | v45.09,12.57 45.79,11.87 C7.1 47.59,11.87 47.59,10.32 47.62,10.29 L1.P$2 47.49,9.43 D5.A 44.2,7.24 43.18,6.22 43.18,2.29 | v61.59,18.29 63.29,18.29 63.5,18.49 | v31.24,13.46 31.24,13.72 30.73,14.22 LED2.A | v15.75,9.4 16.38,9.4 v18.16,11.18 | C15.1 45.61,2.29 43.81,2.29 | C9.1 11.47,27.53 R10.2
+12V
  Bottom 0.406: IC1.5 IC1.4 51.66,6.65 U2.3 50.64,5.66 C5.1 45.38,4.94 SV1.1
D+  (via drill 0.5)
  Top 0.254: v10.92,21.59 11.81,20.7 v11.81,19.81
  Bottom 0.254: JP2.D+ 10.67,21.34 v10.92,21.59 | v11.81,19.81 13.59,19.81 14.48,20.7 IC2.4
D-
  Bottom 0.254: JP2.D- 9.78,20.7 13.77,20.7 IC2.5
GND  (via drill 0.5)
  Bottom 0.254: IC2.3 15.29,20.75 15.88,21.34 15.88,22.1 v15.24,22.73 | IC2.3 15.24,20.7 | IC2.M 16.51,19.56 15.88,18.92 14.99,19.81 14.99,20.5 IC2.3
  other vias: 27.69,6.48 22.61,2.16 17.78,22.73 12.45,25.91 8.51,24.13 13.21,17.27 18.03,26.04 24.13,27.81 47.62,29.08 28.07,8.64 64.14,22.1 58.17,8.76 58.04,5.59 22.61,4.57 36.83,7.49 26.67,15.75 46.35,13.84 51.44,3.05 12.7,30.73
  pour Bottom (isolate 0.254): 3.17,1.14 arc-90 0,4.32 0,30.23 arc-90 3.17,33.4 65.53,33.4 arc-90 68.58,30.35 68.58,4.32 arc-90 65.41,1.14
  pour Top (isolate 0.254): 3.17,1.14 arc-90 0,4.32 0,30.23 arc-90 3.17,33.4 65.53,33.4 arc-90 68.58,30.35 68.58,4.32 arc-90 65.41,1.14
INJ
  Top 0.305: R6.1 25.97,6.16 26.04,6.16 26.04,8.26 27.43,9.65 28.83,9.65 31.24,7.24 35.56,7.24 36.83,5.97 38.1,5.97 38.99,5.08 38.99,4.15 SV1.3
LED_PWM  (via drill 0.5)
  Top 0.305: v13.97,11.94 14.86,12.83 17.91,12.83 19.3,11.43 22.1,11.43 v23.37,12.7 23.37,12.57
  Bottom 0.305: JP1.4 3.3,10.54 5.08,10.54 5.59,10.03 11.18,10.03 12.06,10.92 U1.15 13.05,11.94 v13.97,11.94 | v23.37,12.7 23.28,12.92 R13.2
LIGHTING
  Top 0.305: R7.1 31.56,5.9 32,6.35 35.18,6.35 36.45,5.08 36.45,4.15 SV1.4
N$1
  Bottom 0.406: IC1.3 59.05,7.81 R8.1 R9.1
N$2  (via drill 0.5)
  Top 0.305: 7.21,31.62 LED3.C 7.33,31.62 18.03,31.62 18.38,31.28 LED7.C 18.45,31.28 18.8,31.62 23.5,31.62 | 23.5,31.62 23.62,31.75 | 23.62,31.75 24.13,32.26 v25.4,32.26 26.04,31.62 29.84,31.62 LED4.C 30.19,31.62 38.1,31.62 | LED6.C 61.56,31.28 61.21,31.62 50.04,31.62 38.1,31.62 | LED5.C 38.1,31.62 | 23.62,31.75 23.5,31.62
  Top 0.406: LED8.C 50.04,31.62
  Bottom 0.305: v25.4,32.26 25.4,29.08 26.29,28.19 26.29,22.22 24.51,20.45 R15.1
N$3
  Bottom 0.305: R12.1 28.36,14.93 LED2.C
N$4
  Bottom 0.254: R10.1 14.61,28.5 14.61,26.67 13.84,25.91 13.84,24 14.18,23.67 IC2.9
N$5  (via drill 0.5)
  Top 0.305: v13.97,18.29 13.97,22.22 10.16,26.04 10.16,29.83 S2.1
  Bottom 0.305: U1.24 14.76,18.29 v13.97,18.29
N$6  (via drill 0.5)
  Top 0.305: S4.1 20.23,29.81 20.19,29.59 20.19,21.84 v16.76,18.41
  Bottom 0.305: U1.25 16.76,18.39 v16.76,18.41
N$7  (via drill 0.5)
  Top 0.305: v16.26,15.75 17.02,15.75 27.18,25.91 39.37,25.91 40.26,26.8 41.15,26.8 41.91,27.56 41.91,29.97 41.66,30.23 S3.1
  Bottom 0.305: U1.26 17.91,16.67 17.91,16.64 17.02,15.75 v16.26,15.75
N$8
  Bottom 0.254: IC2.11 14.61,24.64 14.61,25.91 15.75,27.05 16.98,27.05 R11.2
N$10
  Bottom 0.305: C11.1 18.27,18.85 IC2.28
N$11
  Bottom 0.305: R13.1 25.08,15.21 Q1.1
N$12
  Bottom 0.254: IC2.6 13.57,21.21 12.45,21.21 10.41,23.24 10.41,27.05 9.89,27.57 C10.1
N$13  (via drill 0.5)
  Top 0.305: v19.81,13.08 20.95,14.22 20.95,16.76 26.04,21.84 30.48,21.84 31.88,20.45 32.89,20.45 37.08,24.64 47.62,24.64 52.73,29.74 S5.1
  Bottom 0.305: U1.2 19.81,12.1 v19.81,13.08
N$14
  Top 0.305: U3.8 31.61,1.24 C14.2
N$15  (via drill 0.5)
  Top 0.305: v25.65,19.56 v56.13,19.56
  Bottom 0.305: v25.65,19.56 24.59,18.5 Q1.3 23.28,18.5 22.23,19.56 22.23,20.39 R15.2 | R14.2 59.69,16.04
  Bottom 0.406: v56.13,19.56 56.17,19.56 R14.2
N$16
  Bottom 0.305: R14.1 64.72,16 U3.LED-
N$18
  Bottom 0.406: IC1.6 49.88,9.71 L1.P$1 49.79,9.62 D4.C 51.95,13.84 55.88,13.84 56.77,12.95 C6.1
N$19  (via drill 0.5)
  Top 0.406: v50.93,7.62 53.21,9.91 v58.17,9.91
  Bottom 0.406: IC1.1 56.69,9.71 C6.2 56.88,9.91 v58.17,9.91 | D5.C 50.55,7.24 v50.93,7.62
N$20
  Top 0.305: U3.11 26.02,1.4 C12.1
N$21
  Top 0.305: U3.12 24.02,1.59 C12.2
N$22
  Bottom 0.305: JP1.1 6.35,12.57 10.16,12.57 11.21,11.52 U1.16
N$24  (via drill 0.5)
  Top 0.305: 21.13,5.59 Y2.1 18.99,5.64 v19.05,5.59 Y1.3
  Bottom 0.305: U1.7 19.05,7.21 v19.05,5.59 20.32,4.32 C1.1
N$26  (via drill 0.5)
  Top 0.305: JP1.3 6.1,13.59 v6.86,13.59 | v12.32,12.57 13.21,13.46 18.16,13.46 19.56,12.07 20.07,12.07 v26.67,18.67
  Bottom 0.305: v12.32,12.57 12.32,12.8 U1.17 11.46,13.59 v6.86,13.59 | v26.67,18.67 27.27,18.67 LED1.A
N$27  (via drill 0.5)
  Top 0.305: v27.81,24.89 28.19,25.27 40.26,25.27 v40.89,25.91
  Bottom 0.305: IC3.14 28.19,25.27 v27.81,24.89 | v40.89,25.91 46.35,25.91 B1.+
N$30  (via drill 0.5)
  Top 0.305: R6.2 24.07,8.19 v26.92,11.05
  Bottom 0.305: U1.32 U1.1 24.63,11.52 D7.C D2.C 26.92,12.45 v26.92,11.05
N$31  (via drill 0.5)
  Top 0.305: R7.2 29.66,6.16 v28.45,7.37 | v22.86,9.4 22.35,9.91 18.03,9.91 v16,11.94
  Bottom 0.305: D8.C D3.C 28.96,4.96 28.96,6.86 v28.45,7.37 24.89,7.37 v22.86,9.4 | U1.23 15.38,16.53 15.38,13.35 16,12.73 v16,11.94
N$32
  Bottom 0.305: R2.1 30.06,19.36 LED1.C
N$36  (via drill 0.5)
  Top 0.305: v24.13,10.41 24.13,9.27 21.97,7.11 v16.51,7.11
  Bottom 0.305: v24.13,10.41 D6.C D1.C 27.04,9.77 27.94,10.67 31.68,10.67 R5.2 | v16.51,7.11 15.9,7.11 U1.9
N$37  (via drill 0.5)
  Top 0.305: 13.72,3.17 13.84,3.29 Y1.1 14.4,4.43 17.92,4.43 v18.92,3.43 19.23,3.25 Y2.3
  Bottom 0.305: 17.27,7.75 17.46,7.56 U1.8 17.53,7.52 C4.2 17.92,4.43 v18.92,3.43
RST  (via drill 0.5)
  Top 0.305: v16,10.54 14.73,10.54 9.91,5.71 v9.91,3.94 10.25,3.59 R1.2
  Bottom 0.305: v9.91,3.94 8.99,3.94 8.89,4.04 S1.2 7.9,5.94 JP1.5 | C11.2 20.32,17.34 20.32,15.75 19.9,15.33 U1.29 19.68,15.11 19.3,14.73 19.3,13.84 v16,10.54
RX
  Bottom 0.254: IC2.26 17.86,20.75 18.54,20.07 19.05,20.07 21.34,17.78 21.34,15.7 U1.30
SCL  (via drill 0.5)
  Top 0.305: U3.4 38.79,1.58 39.5,2.29 40.13,2.29 40.77,2.92 40.77,5.46 v38.73,7.49 | v18.41,14.61 18.41,15.24 25.91,22.73 v29.21,22.73
  Bottom 0.305: U1.28 18.41,15.04 v18.41,14.61 | v38.73,7.49 38.73,13.21 v29.21,22.73 IC3.16 33.68,22.73 34.45,21.97 R4.2
SDA  (via drill 0.5)
  Top 0.305: v16.76,14.61 26.16,24 v29.21,24 29.72,24 v32.38,21.34
  Bottom 0.305: U3.5 38.23,2.46 38.23,5.33 39.75,6.86 39.75,13.97 v32.38,21.34 | R3.2 IC3.15 v29.21,24 | v16.76,14.61 16.84,14.61 U1.27
TEMP  (via drill 0.5)
  Top 0.305: v11.43,8.76 11.43,12.95 15.11,16.64 17.02,16.64 27.05,26.67 37.59,26.67 v38.73,27.81
  Bottom 0.305: U1.14 11.43,9.19 v11.43,8.76 | U4.1 37.42,31.58 36.83,30.99 36.83,27.62 R16.1 37.15,27.81 v38.73,27.81
TX
  Bottom 0.254: IC2.25 18.67,20.57 19.43,20.57 21.97,18.03 21.97,15.21 U1.31
VSS  (via drill 0.5)
  Top 0.305: v34.29,8.76 38.73,8.76 41.91,5.59 41.91,4.28 SV1.2
  Bottom 0.305: R5.1 34.1,8.58 v34.29,8.76

### Text on the board
tPlace: Version 0.1 / carspd.hybridair.me / Blake Stratton / 07.11.2017
bPlace: STAT | PWR
bNames: ICSP